# EAGLE design V1 (EAGLE 7.1.0)
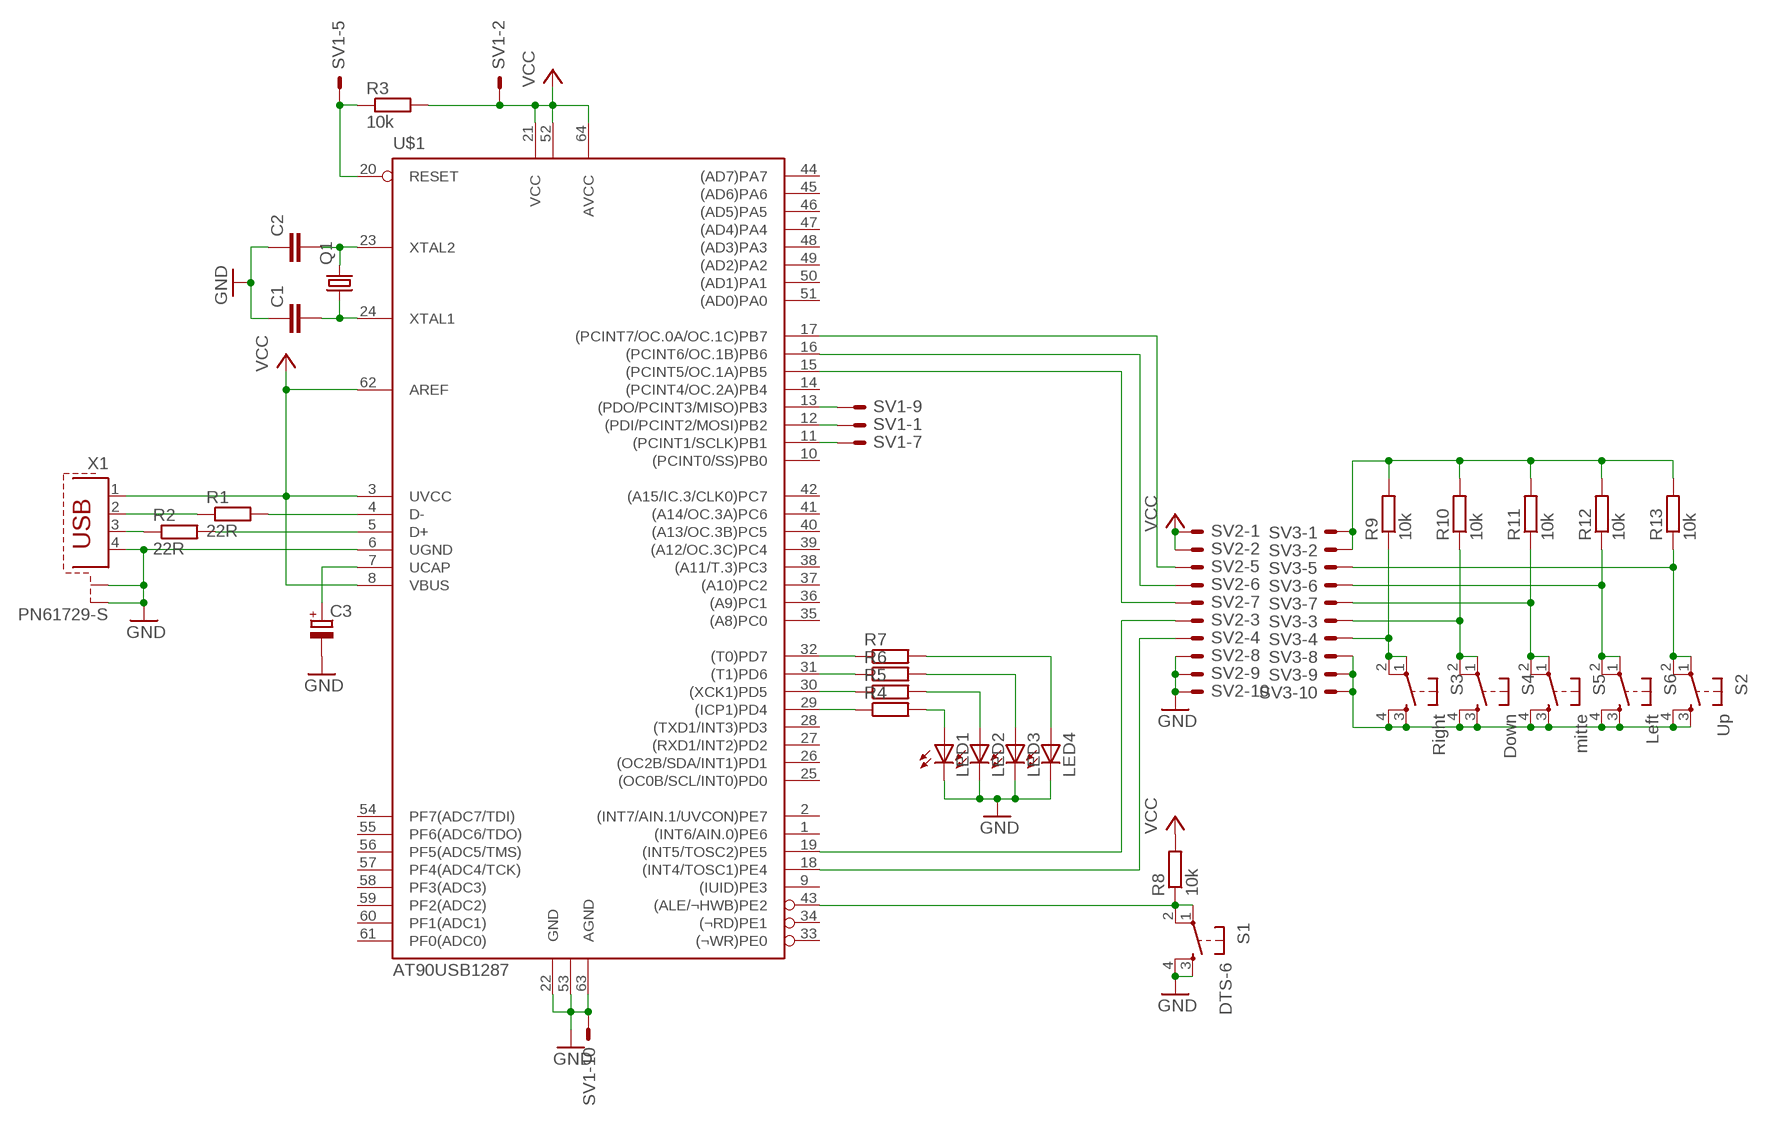
[diagram p0: schematic, sheet 1]

## Parts
C1  C-EUC1206K  [C1206K]
C2  C-EUC1206K  [C1206K]
C3  CPOL-EUE2-5  [E2-5]
LED1  LED3MM  [LED3MM]
LED2  LED3MM  [LED3MM]
LED3  LED3MM  [LED3MM]
LED4  LED3MM  [LED3MM]
Q1  CRYSTALSM77H  [SM77H]
R1  22R  R-EU_M1206  [M1206]
R2  22R  R-EU_M1206  [M1206]
R3  10k  R-EU_0207/10  [0207/10]
R4  R-EU_0207/10  [0207/10]
R5  R-EU_0207/10  [0207/10]
R6  R-EU_0207/10  [0207/10]
R7  R-EU_0207/10  [0207/10]
R8  10k  R-EU_M1206  [M1206]
R9  10k  R-EU_M1206  [M1206]
R10  10k  R-EU_M1206  [M1206]
R11  10k  R-EU_M1206  [M1206]
R12  10k  R-EU_M1206  [M1206]
R13  10k  R-EU_M1206  [M1206]
S1  DTS-6  [DTS-6]
S2  Up  DTS-6  [DTS-6]
S3  Right  DTS-6  [DTS-6]
S4  Down  DTS-6  [DTS-6]
S5  mitte  DTS-6  [DTS-6]
S6  Left  DTS-6  [DTS-6]
SV1  ML10E  [ML10]
SV2  ML10E  [ML10]
SV3  ML10E  [ML10]
U$1  AT90USB1287  [TQFP64]
X1  PN61729-S  [PN61729-S]

## Nets
GND: C1.1 C2.1 C3.- LED1.K(C) LED2.K(C) LED3.K(C) LED4.K(C) S1.3 S1.4 SV1.10 SV2.8 SV2.9 SV2.10 U$1.6(UGND) U$1.22(GND) U$1.53(GND1) U$1.63(AGND) X1.4 X1.S1 X1.S2
N$1: R1.2 U$1.4(D-)
N$2: R2.2 U$1.5(D+)
N$3: R1.1 X1.2
N$4: R2.1 X1.3
N$5: C2.2 Q1.3 U$1.23(XTAL2)
N$6: C1.2 Q1.1 U$1.24(XTAL1)
N$7: R4.1 U$1.29((ICP1)PD4)
N$8: C3.+ U$1.7(UCAP)
N$9: R5.1 U$1.30((XCK1)PD5)
N$10: R6.1 U$1.31((T1)PD6)
N$11: R3.1 SV1.5 U$1.20(RESET)
N$12: SV1.9 U$1.13((PDO/PCINT3/MISO)PB3)
N$13: SV1.1 U$1.12((PDI/PCINT2/MOSI)PB2)
N$14: SV1.7 U$1.11((PCINT1/SCLK)PB1)
N$15: R7.1 U$1.32((T0)PD7)
N$16: LED1.A R4.2
N$17: LED2.A R5.2
N$18: LED3.A R6.2
N$19: LED4.A R7.2
N$20: R8.1 S1.1 S1.2 U$1.43((ALE/¬HWB)PE2)
N$21: R13.1 S2.1 S2.2 SV3.5
N$22: R12.1 S6.1 S6.2 SV3.6
N$23: SV2.4 U$1.18((INT4/TOSC1)PE4)
N$24: SV2.3 U$1.19((INT5/TOSC2)PE5)
N$25: SV2.7 U$1.15((PCINT5/OC.1A)PB5)
N$26: SV2.6 U$1.16((PCINT6/OC.1B)PB6)
N$27: SV2.5 U$1.17((PCINT7/OC.0A/OC.1C)PB7)
N$28: R11.1 S5.1 S5.2 SV3.7
N$29: R10.1 S4.1 S4.2 SV3.3
N$30: R9.1 S3.1 S3.2 SV3.4
N$31: S2.3 S2.4 S3.3 S3.4 S4.3 S4.4 S5.3 S5.4 S6.3 S6.4 SV3.8 SV3.9 SV3.10
N$32: R9.2 R10.2 R11.2 R12.2 R13.2 SV3.1 SV3.2
VCC: R3.2 R8.2 SV1.2 SV2.1 SV2.2 U$1.3(UVCC) U$1.8(VBUS) U$1.21(VCC) U$1.52(VCC1) U$1.62(AREF) U$1.64(AVCC) X1.1
Unconnected: SV1.3 SV1.4 SV1.6 SV1.8 U$1.1((INT6/AIN.0)PE6) U$1.2((INT7/AIN.1/UVCON)PE7) U$1.9((IUID)PE3) U$1.10((PCINT0/SS)PB0) U$1.14((PCINT4/OC.2A)PB4) U$1.25((OC0B/SCL/INT0)PD0) U$1.26((OC2B/SDA/INT1)PD1) U$1.27((RXD1/INT2)PD2) U$1.28((TXD1/INT3)PD3) U$1.33((¬WR)PE0) U$1.34((¬RD)PE1) U$1.35((A8)PC0) U$1.36((A9)PC1) U$1.37((A10)PC2) U$1.38((A11/T.3)PC3) U$1.39((A12/OC.3C)PC4) U$1.40((A13/OC.3B)PC5) U$1.41((A14/OC.3A)PC6) U$1.42((A15/IC.3/CLK0)PC7) U$1.44((AD7)PA7) U$1.45((AD6)PA6) U$1.46((AD5)PA5) U$1.47((AD4)PA4) U$1.48((AD3)PA3) U$1.49((AD2)PA2) U$1.50((AD1)PA1) U$1.51((AD0)PA0) U$1.54(PF7(ADC7/TDI)) U$1.55(PF6(ADC6/TDO)) U$1.56(PF5(ADC5/TMS)) U$1.57(PF4(ADC4/TCK)) U$1.58(PF3(ADC3)) U$1.59(PF2(ADC2)) U$1.60(PF1(ADC1)) U$1.61(PF0(ADC0))

## Library data of the parts
C1 C2 = rcl:C-EU: CAPACITOR, European symbol
C3 = rcl:CPOL-EU: POLARIZED CAPACITOR, European symbol
LED1-LED4 = led:LED: LED OSRAM: - CHIPLED LG R971, LG N971, LY N971, LG Q971, LY Q971, LO R971, LY R971 LH N974, LH R974 LS Q976, LO Q976, LY Q976 LO Q996 - Hyper CHIPLED LW Q18S LB Q993, LB Q99A, LB R99A - SideLED LS A670, LO A670, LY A670, LG A670, LP A670 LB A673, LV A673, LT A673, LW A673 LH A674 LY A675 LS A676, LA A676, LO A676, LY A676, LW A676 LS A679, LY A679, LG A679 - Hyper Micro SIDELED® LS Y876, LA Y876, LO Y876, LY Y876 LT Y87S - SmartLED LW L88C, LW L88S LB L89C, LB L89S, LG L890 LS L89K, LO L89K, LY L89K LS L896, LA L896, LO L896, LY L896 - TOPLED LS T670, LO T670, LY T670, LG T670, LP T670 LSG T670, LSP T670, LSY T670, LOP T670, LYG T670 LG T671, LOG T671, LSG T671 LB T673, LV T673, LT T673, LW T673 LH T674 LS T676, LA T676, LO T676, LY T676, LB T676, LH T676, LSB T676, LW T676 LB T67C, LV T67C, LT T67C, LS T67K, LO T67K, LY T67K, LW E67C LS E67B, LA E67B, LO E67B, LY E67B, LB E67C, LV E67C, LT E67C LW T67C LS T679, LY T679, LG T679 LS T770, LO T770, LY T770, LG T770, LP T770 LB T773, LV T773, LT T773, LW T773 LH T774 LS E675, LA E675, LY E675, LS T675 LS T776, LA T776, LO T776, LY T776, LB T776 LHGB T686 LT T68C, LB T68C - Hyper Mini TOPLED® LB M676 - Mini TOPLED Santana® LG M470 LS M47K, LO M47K, LY M47K Source: http://www.osram.convergy.de LUXEON: - LUMILED® LXK2-PW12-R00, LXK2-PW12-S00, LXK2-PW14-U00, LXK2-PW14-V00 LXK2-PM12-R00, LXK2-PM12-S00, LXK2-PM14-U00 LXK2-PE12-Q00, LXK2-PE12-R00, LXK2-PE12-S00, LXK2-PE14-T00, LXK2-PE14-U00 LXK2-PB12-K00, LXK2-PB12-L00, LXK2-PB12-M00, LXK2-PB14-N00, LXK2-PB14-P00, LXK2-PB14-Q00 LXK2-PR12-L00, LXK2-PR12-M00, LXK2-PR14-Q00, LXK2-PR14-R00 LXK2-PD12-Q00, LXK2-PD12-R00, LXK2-PD12-S00 LXK2-PH12-R00, LXK2-PH12-S00 LXK2-PL12-P00, LXK2-PL12-Q00, LXK2-PL12-R00 Source: www.luxeon.com KINGBRIGHT: KA-3528ASYC Source: www.kingbright.com
Q1 = crystal:CRYSTAL: CRYSTAL
R1-R13 = rcl:R-EU_: RESISTOR, European symbol
S1-S6 = switch-tact:DTS-6
SV1-SV3 = con-harting-ml:ML10?E: HARTING; OC_FARNELL: unknown; OC_NEWARK: unknown
U$1 = atmelusb:AT90USB1287
X1 = con-berg:PN61729-S: BERG USB connector; OC_FARNELL: unknown; OC_NEWARK: unknown

## Board
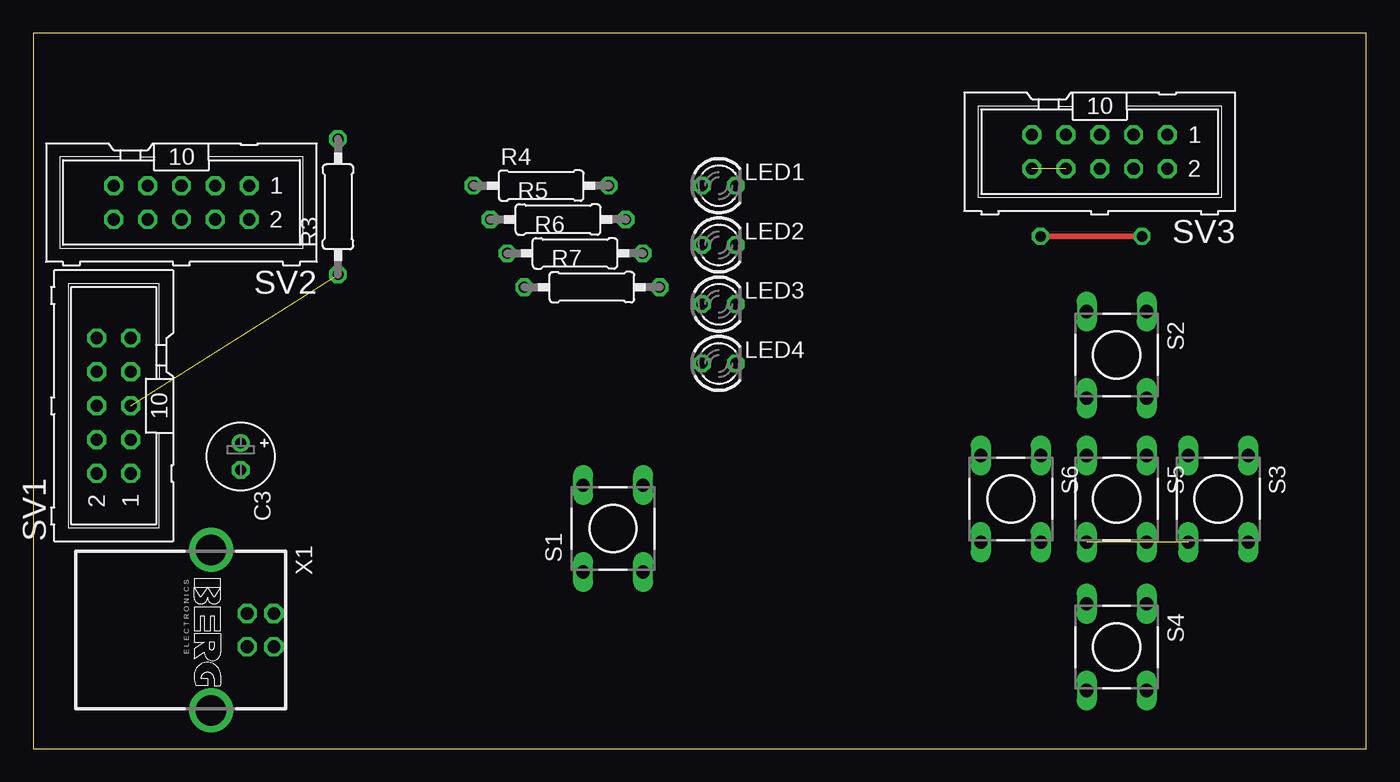
[diagram p1: board, top side]
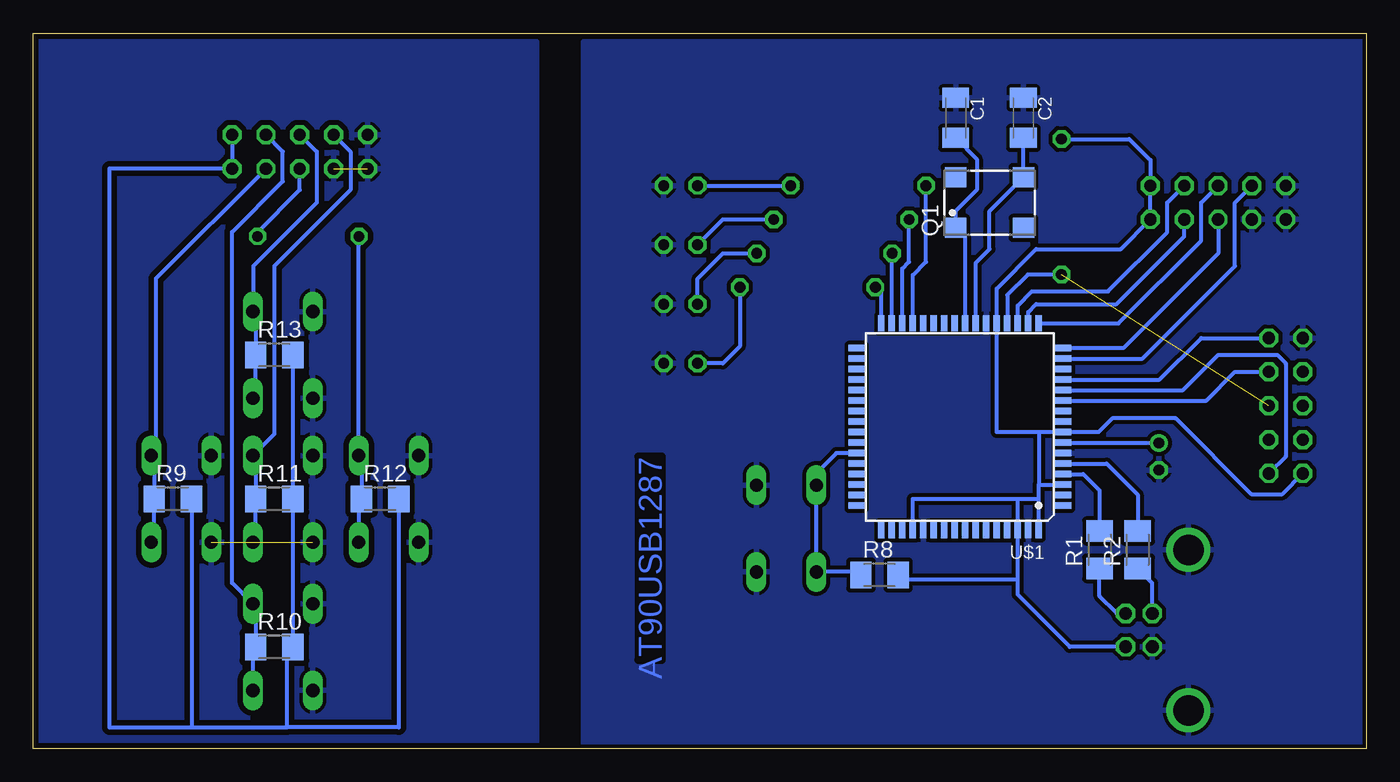
[diagram p2: board, bottom side, seen from below]

Size 100 x 53.65 mm. Coordinates in mm from the lower left corner, seen from the top.
Outline: 0,0 100,0 100,53.65 0,53.65 0,0
Copper layers (1*16): Top 0.035mm / dielectric 1.5mm / Bottom 0.035mm
Design rules "default *": minimum track width 10mil, minimum drill 24mil, track to track 10mil, track to pad 10mil, pad to pad 10mil, via to via 10mil, smd to smd 8mil, copper to edge 10mil, drill to drill 8mil, minimum pad ring 10mil, minimum via ring 8mil, stop-mask expansion 4mil, vias tented up to drill 0mil, thermal gap 10mil

### Footprints (pad centres in the part's own frame; a part is rotated, then mirrored left to right if it is on the bottom)
C1206K = smd 1.5 x 2: 1 -1.5,0; 2 1.5,0
E2-5 = drill 0.813 pad 1.27: + -1.016,0 | drill 0.813 pad 1.27 octagon: - 1.016,0
LED3MM = drill 0.813 octagon: A -1.27,0; K 1.27,0
SM77H = smd 1.6 x 1.5: 1 -2.55,-1.9; 2 2.55,-1.9; 3 2.55,1.9; 4 -2.55,1.9
M1206 = smd 1.6 x 2: 1 -1.4,0; 2 1.4,0
0207/10 = drill 0.813 octagon: 1 -5.08,0; 2 5.08,0
DTS-6 = drill 1 long: 1 -3.25,2.25; 2 3.25,2.25; 3 -3.25,-2.25; 4 3.25,-2.25
ML10 = drill 0.914 octagon: 1 -5.08,-1.27; 2 -5.08,1.27; 3 -2.54,-1.27; 4 -2.54,1.27; 5 0,-1.27; 6 0,1.27; 7 2.54,-1.27; 8 2.54,1.27; 9 5.08,-1.27; 10 5.08,1.27
TQFP64 = smd 1.194 x 0.483: 1 -7.76,5.905; 2 -7.76,5.118; 3 -7.76,4.331; 4 -7.76,3.543; 5 -7.76,2.756; 6 -7.76,1.968; 7 -7.76,1.181; 8 -7.76,0.394; 9 -7.76,-0.394; 10 -7.76,-1.181; 11 -7.76,-1.968; 12 -7.76,-2.756; 13 -7.76,-3.543; 14 -7.76,-4.331; 15 -7.76,-5.118; 16 -7.76,-5.905; 33 7.76,-5.905; 34 7.76,-5.118; 35 7.76,-4.331; 36 7.76,-3.543; 37 7.76,-2.756; 38 7.76,-1.968; 39 7.76,-1.181; 40 7.76,-0.394; 41 7.76,0.394; 42 7.76,1.181; 43 7.76,1.968; 44 7.76,2.756; 45 7.76,3.543; 46 7.76,4.331; 47 7.76,5.118; 48 7.76,5.905 | smd 0.483 x 1.194: 17 -5.905,-7.76; 18 -5.118,-7.76; 19 -4.331,-7.76; 20 -3.543,-7.76; 21 -2.756,-7.76; 22 -1.968,-7.76; 23 -1.181,-7.76; 24 -0.394,-7.76; 25 0.394,-7.76; 26 1.181,-7.76; 27 1.968,-7.76; 28 2.756,-7.76; 29 3.543,-7.76; 30 4.331,-7.76; 31 5.118,-7.76; 32 5.905,-7.76; 49 5.905,7.76; 50 5.118,7.76; 51 4.331,7.76; 52 3.543,7.76; 53 2.756,7.76; 54 1.968,7.76; 55 1.181,7.76; 56 0.394,7.76; 57 -0.394,7.76; 58 -1.181,7.76; 59 -1.968,7.76; 60 -2.756,7.76; 61 -3.543,7.76; 62 -4.331,7.76; 63 -5.118,7.76; 64 -5.905,7.76
PN61729-S = drill 0.95 octagon: 1 1.25,4.71; 2 -1.25,4.71; 3 -1.25,2.71; 4 1.25,2.71 | drill 2.3 pad 2.9: S1 -6.02,0; S2 6.02,0

### Placement (x,y rotation side)
C1  30.8,47.31 270 bottom
C2  25.72,47.31 270 bottom
C3  15.56,21.91 270 top
LED1  51.44,42.23 0 top
LED2  51.44,37.78 0 top
LED3  51.44,33.34 0 top
LED4  51.44,28.89 0 top
Q1  28.26,40.96 0 bottom
R1  20,14.92 90 bottom
R2  17.14,14.92 90 bottom
R3  22.86,40.64 90 top
R4  38.1,42.23 0 top
R5  39.37,39.69 0 top
R6  40.64,37.15 0 top
R7  41.91,34.61 0 top
R8  36.51,13.02 0 bottom
R9  89.53,18.73 0 bottom
R10  81.92,7.62 0 bottom
R11  81.92,18.73 0 bottom
R12  73.98,18.73 0 bottom
R13  81.92,29.53 0 bottom
S1  43.5,16.51 90 top
S2  81.28,29.53 270 top
S3  88.9,18.73 270 top
S4  81.28,7.62 270 top
S5  81.28,18.73 270 top
S6  73.34,18.73 270 top
SV1  6.03,25.72 90 top
SV2  11.11,40.96 180 top
SV3  80.01,44.77 180 top
U$1  30.48,24.13 180 bottom
X1  13.34,8.89 270 top

### Tracks (layer width: path | path; a pad name or v marks a point on that pad's centre or on a via)
GND
  pour Bottom (isolate 0.305): 0,0 58.74,0 58.74,53.02 0,53.02
N$1
  Bottom 0.305: U$1.4 21.22,20.59 20,19.37 R1.2
N$2
  Bottom 0.305: U$1.5 19.47,21.37 17.14,19.05 R2.2
N$3
  Bottom 0.305: X1.2 18.71,10.14 20,11.43 R1.1
N$4
  Bottom 0.305: X1.3 16.05,12.42 R2.1
N$5
  Bottom 0.305: C2.2 25.71,45.8 Q1.3 28.26,40.31 28.26,37.47 29.3,36.42 U$1.23
N$6
  Bottom 0.305: U$1.24 30.09,38.34 Q1.1 30.81,40.31 29.21,41.91 29.21,44.22 C1.2
N$7
  Bottom 0.305: U$1.29 34.02,35.51 33.02,36.51 R4.1
N$8
  Bottom 0.305: U$1.7 15.71,22.95 C3.+
N$9
  Bottom 0.305: U$1.30 34.81,35.99 34.29,36.51 R5.1
N$10
  Bottom 0.305: U$1.31 35.6,37.11 R6.1
N$11  (1 unrouted)
  Bottom 0.305: R3.1 25.4,35.56 26.94,34.02 U$1.20
N$12
  Bottom 0.305: U$1.13 15.51,27.67 12.38,30.8 SV1.9
N$13
  Bottom 0.305: U$1.12 13.75,26.89 11.11,29.53 6.67,29.53 6.03,28.89 6.03,21.91 SV1.1
N$14
  Bottom 0.305: U$1.11 12,26.1 9.84,28.26 SV1.7
N$15
  Bottom 0.305: U$1.32 36.39,34.16 R7.1
N$16
  Bottom 0.305: LED1.A R4.2
N$17
  Bottom 0.305: LED2.A 48.26,39.69 R5.2
N$18
  Bottom 0.305: LED3.A 50.16,35.24 48.26,37.15 R6.2
N$19
  Bottom 0.305: R7.2 46.99,30.16 48.26,28.89 LED4.A
N$20
  Bottom 0.305: R8.1 38.16,13.26 S1.1 S1.2 41.25,20.66 39.75,22.16 U$1.43
N$21
  Bottom 0.305: S2.2 83.31,26.28 R13.1 83.31,32.78 S2.1 83.5,32.8 83.5,36.2 78.74,40.96 78.74,44.77 SV3.5
N$22  (via drill 0.8 pad 1.27)
  Top 0.406: v75.56,38.42 v83.19,38.42
  Bottom 0.305: S6.2 75.59,18.73 R12.1 75.38,21.98 S6.1 75.59,37.76 v75.56,38.42 | v83.19,38.42 83.19,38.73 80.01,41.91 SV3.6
N$23
  Bottom 0.305: U$1.18 25.36,32.74 24.77,33.34 18.73,33.34 13.65,38.42 SV2.4
N$24
  Bottom 0.305: U$1.19 26.15,33.22 25.08,34.29 19.37,34.29 14.92,38.73 14.92,40.96 SV2.3
N$25
  Bottom 0.305: U$1.15 16.79,29.25 9.84,36.2 9.84,40.96 SV2.7
N$26
  Bottom 0.305: SV2.6 11.11,37.15 18.22,30.04 U$1.16
N$27
  Bottom 0.305: U$1.17 18.59,31.89 12.38,38.1 12.38,40.96 SV2.5
N$28
  Bottom 0.305: S5.2 83.31,15.48 R11.1 83.31,21.98 S5.1 81.92,23.6 81.92,36.2 76.2,41.91 76.2,44.77 SV3.7
N$29
  Bottom 0.305: S4.2 83.53,7.62 R10.1 83.31,10.87 S4.1 85.09,12.43 85.09,38.73 81.28,42.55 81.28,44.77 SV3.3
N$30
  Bottom 0.305: S3.2 90.94,15.48 R9.1 90.94,21.98 S3.1 90.88,21.98 90.81,21.91 90.81,35.24 SV3.4
N$31  (2 unrouted)
  pour Bottom (isolate 0.406): 62.23,0.32 99.69,0.32 99.69,53.02 62.23,53.02
N$32
  Bottom 0.305: SV3.1 SV3.2 94.3,43.5 94.3,1.59 88.14,1.59 | 88.14,1.59 80.96,1.59 | 80.96,1.59 80.96,7.62 R10.2 R11.2 R13.2 | R12.2 72.58,1.59 80.96,1.59 | R9.2 88.14,1.59
VCC
  Bottom 0.305: U$1.64 24.57,18.73 | 24.57,18.73 24.57,19.8 | 24.57,19.8 U$1.3 | U$1.52 34.02,18.73 26.15,18.73 | 26.15,18.73 24.57,18.73 | 26.15,18.73 U$1.62 26.15,12.7 | X1.1 22.25,7.64 26.15,11.54 26.15,12.7 | R8.2 34.8,12.7 26.15,12.7 | 24.57,23.74 U$1.8 20.08,23.74 19.05,24.77 14.29,24.77 8.57,19.05 6.35,19.05 SV1.2 | 24.57,23.74 24.57,19.8 | R3.2 17.78,45.72 16.19,44.13 SV2.1 SV2.2 18.41,37.47 24.77,37.47 27.72,34.51 U$1.21 27.72,23.74 24.57,23.74

### Text on the board
Bottom: AT90USB1287